# Altium schematic sheet BusOutput.SchDoc: StepMotor Controller
size A4; Organization: NTUST EE-305; Address1: No.43, Sec. 4, Keelung Rd.; Address2: Da’an Dist.; Address3: Taipei 106; Address4: Taiwan (R.O.C.); DocumentNumber: 7; Revision: 1.0; SheetNumber: 7; SheetTotal: 8
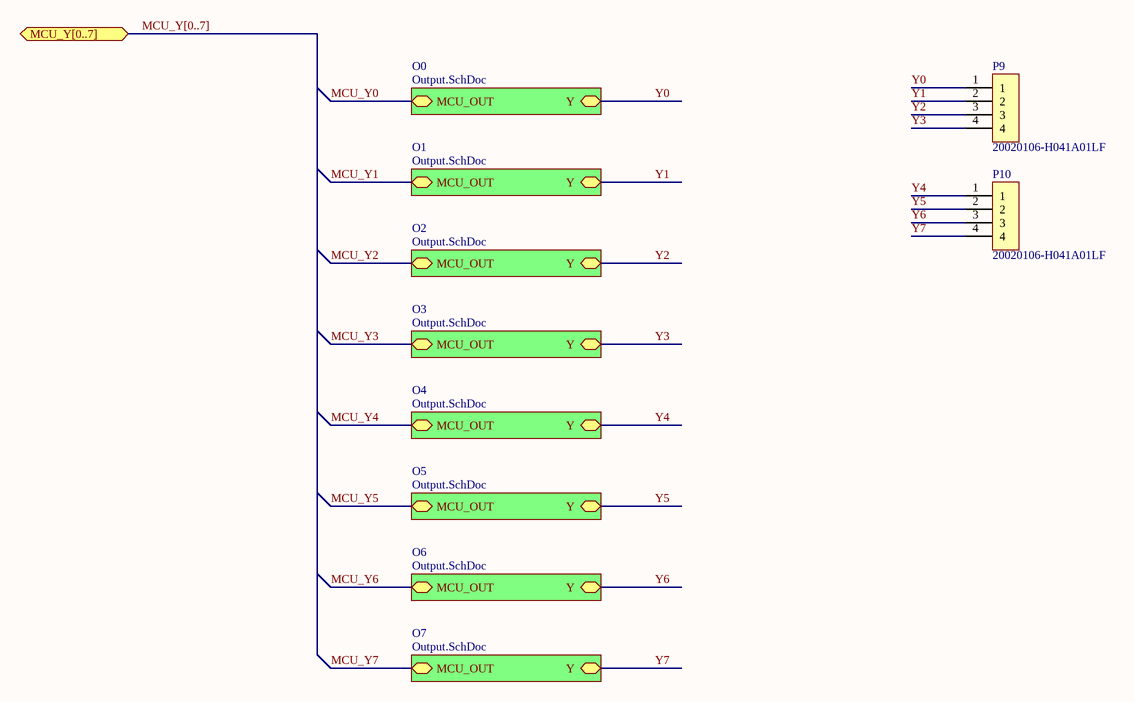
[diagram p0: BusOutput.SchDoc]

## Parts
P9  20020106-H041A01LF  [20020106-H041A01LF]
P10  20020106-H041A01LF  [20020106-H041A01LF]

## Sub-sheets
O0 = Output.SchDoc: MCU_OUT, Y
O1 = Output.SchDoc: MCU_OUT, Y
O2 = Output.SchDoc: MCU_OUT, Y
O3 = Output.SchDoc: MCU_OUT, Y
O4 = Output.SchDoc: MCU_OUT, Y
O5 = Output.SchDoc: MCU_OUT, Y
O6 = Output.SchDoc: MCU_OUT, Y
O7 = Output.SchDoc: MCU_OUT, Y

## Ports
MCU_Y[0..7]

## Nets
MCU_Y0: sheet O0/MCU_OUT
MCU_Y1: sheet O1/MCU_OUT
MCU_Y2: sheet O2/MCU_OUT
MCU_Y3: sheet O3/MCU_OUT
MCU_Y4: sheet O4/MCU_OUT
MCU_Y5: sheet O5/MCU_OUT
MCU_Y6: sheet O6/MCU_OUT
MCU_Y7: sheet O7/MCU_OUT
Y0: P9.1 ; sheet O0/Y
Y1: P9.2 ; sheet O1/Y
Y2: P9.3 ; sheet O2/Y
Y3: P9.4 ; sheet O3/Y
Y4: P10.1 ; sheet O4/Y
Y5: P10.2 ; sheet O5/Y
Y6: P10.3 ; sheet O6/Y
Y7: P10.4 ; sheet O7/Y

## Buses and harness runs
bus MCU_Y[0..7] = port MCU_Y[0..7]

## Notes on the sheet
- Title
- Name
- Size:
- Revision:
- A4
- Date:
- Time:
- Sheet
- of

## Library data of the parts
P9 P10 = Amphenol FCI: TERM BLOCK HDR 4POS VERT 5.08MM